# EAGLE design V3 (EAGLE 9.6.2)
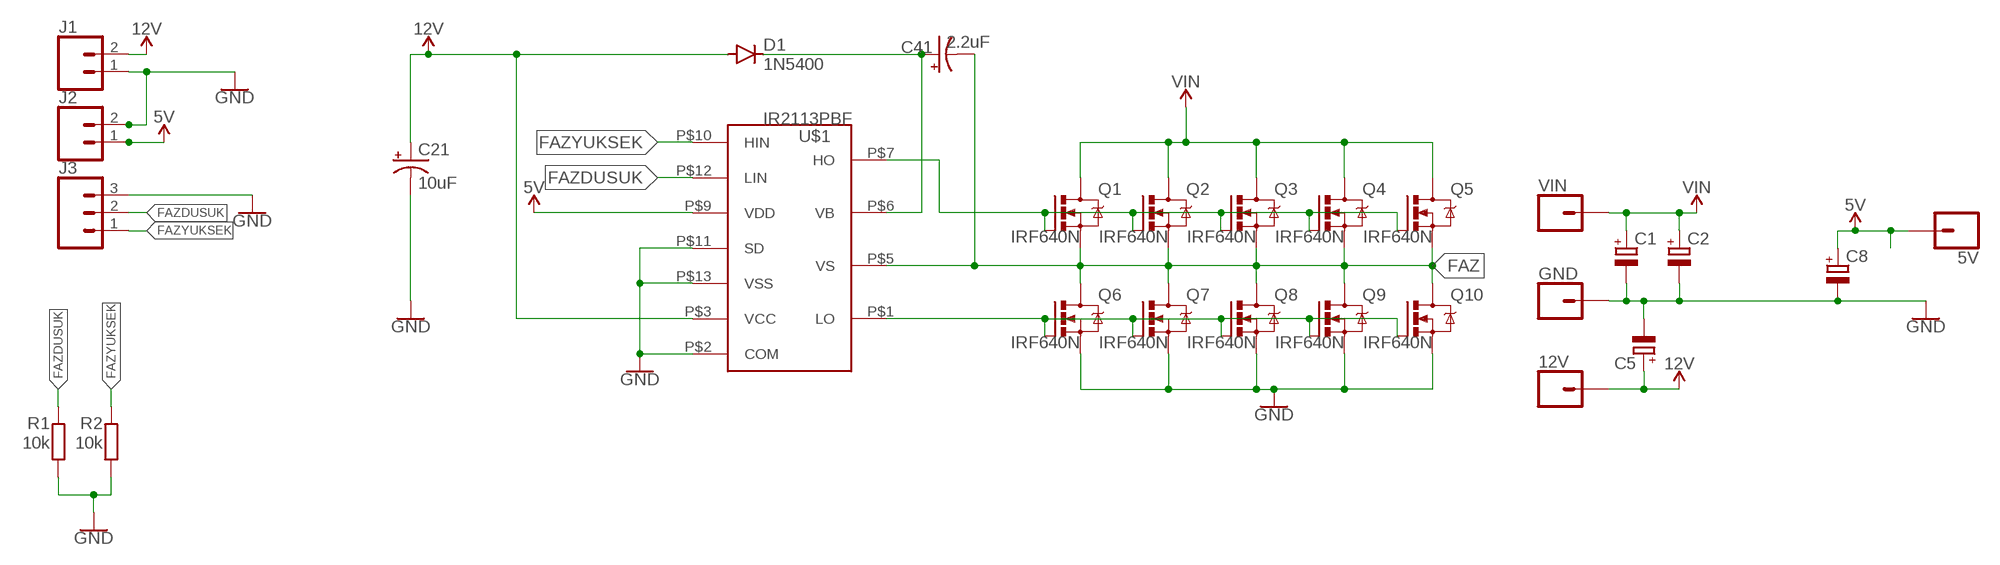
[diagram p0: schematic, sheet 1]

## Parts
5V  CONN_01SNAP-MALE  [SNAP-MALE]
12V  CONN_01SNAP-MALE  [SNAP-MALE]
C1  16MM-DIA-CAPASITOR  [16MM-DIA-CAPASITOR]
C2  16MM-DIA-CAPASITOR  [16MM-DIA-CAPASITOR]
C5  16MM-DIA-CAPASITOR  [16MM-DIA-CAPASITOR]
C8  16MM-DIA-CAPASITOR  [16MM-DIA-CAPASITOR]
C21  10uF  10UF-POLAR-RADIAL-2.5MM-25V-20%  [CPOL-RADIAL-2.5MM-5MM]
C41  2.2uF  10UF-POLAR-RADIAL-2.5MM-25V-20%  [CPOL-RADIAL-2.5MM-5MM]
D1  1N5400  [DO201-15]
GND  CONN_01SNAP-MALE  [SNAP-MALE]
J1  CONN_025MM  [SCREWTERMINAL-5MM-2]
J2  CONN_025MM  [SCREWTERMINAL-5MM-2]
J3  CONN_03-SCREW-5MM  [SCREWTERMINAL-5MM-3]
Q1  IRF640N  [TO-220-PAD]
Q2  IRF640N  [TO-220-PAD]
Q3  IRF640N  [TO-220-PAD]
Q4  IRF640N  [TO-220-PAD]
Q5  IRF640N  [TO-220-PAD]
Q6  IRF640N  [TO-220-PAD]
Q7  IRF640N  [TO-220-PAD]
Q8  IRF640N  [TO-220-PAD]
Q9  IRF640N  [TO-220-PAD]
Q10  IRF640N  [TO-220-PAD]
R1  10k  R-EU_0207/10  [0207/10]
R2  10k  R-EU_0207/10  [0207/10]
U$1  IR2113PBF  [PDIP-14]
VIN  CONN_01SNAP-MALE  [SNAP-MALE]

## Nets
5V: 5V.2 C8.+ J2.1 U$1.P$9(VDD)
12V: 12V.2 C5.+ C21.1(+) D1.A J1.2 U$1.P$3(VCC)
FAZ: C41.2(-) Q1.3(S) Q2.3(S) Q3.3(S) Q4.3(S) Q5.3(S) Q6.TAB(D) Q7.TAB(D) Q8.TAB(D) Q9.TAB(D) Q10.TAB(D) U$1.P$5(VS)
FAZ_A_L: Q6.1(G) Q7.1(G) Q8.1(G) Q9.1(G) Q10.1(G) U$1.P$1(LO)
FAZDUSUK: J3.2 R1.2 U$1.P$12(LIN)
FAZYUKSEK: J3.1 R2.2 U$1.P$10(HIN)
GND: C1.- C2.- C5.- C8.- C21.2(-) GND.2 J1.1 J2.2 J3.3 Q6.3(S) Q7.3(S) Q8.3(S) Q9.3(S) Q10.3(S) R1.1 R2.1 U$1.P$2(COM) U$1.P$11(SD) U$1.P$13(VSS)
N$1: Q1.1(G) Q2.1(G) Q3.1(G) Q4.1(G) Q5.1(G) U$1.P$7(HO)
N$4: C41.1(+) D1.C U$1.P$6(VB)
VIN: C1.+ C2.+ Q1.TAB(D) Q2.TAB(D) Q3.TAB(D) Q4.TAB(D) Q5.TAB(D) VIN.2

## Library data of the parts
5V 12V GND VIN = SparkFun-Connectors:CONN_01: Single connection point. Often used as Generic Header-pin footprint for 0.1 inch spaced/style header connections On any of the 0.1 inch spaced packages, you can populate with these: Break Away Headers - Straight <https://www.sparkfun.com/products/116> (PRT-00116) Break Away Male Headers - Right Angle <https://www.sparkfun.com/products/553> (PRT-00553) Female Headers <https://www.sparkfun.com/products/115> (PRT-00115) Break Away Headers - Machine Pin <https://www.sparkfun.com/products/117> (PRT-00117) Break Away Female Headers - Swiss Machine Pin <https://www.sparkfun.com/products/743> (PRT-00743) This device is also useful as a general connection point to wire up your design to another part of your project. Our various solder wires solder well into these plated through hole pads. Hook-Up Wire - Assortment (Stranded, 22 AWG) <https://www.sparkfun.com/products/11375> (PRT-11375) Hook-Up Wire - Assortment (Solid Core, 22 AWG) <https://www.sparkfun.com/products/11367> (PRT-11367) View the entire wire category on our website here <https://www.sparkfun.com/categories/141> Special notes: SMTSO-256-ET is a "flush mount" nut for a 4-40 screw. We mostly use this on specialty testbeds; it is a nice way to connect hardware to your PCB at an adjustable hieght. Also note, the SNAP packages are for using a snappable style connector. We sell a baggie of snaps and they are also used on two LilyPad designs: Snap Assortment - 30 pack (male and female) <https://www.sparkfun.com/products/11347> (DEV-11347) LilyPad Arduino SimpleSnap <https://www.sparkfun.com/products/10941> (DEV-10941) LilyPad SimpleSnap Protoboard <https://www.sparkfun.com/products/10940> (DEV-10940)
C1 C2 C5 C8 = El_yapimi:16MM-DIA-CAPASITOR
C21 = SparkFun-Capacitors:10UF-POLAR: 10.0µF polarized capacitors A capacitor is a passive two-terminal electrical component used to store electrical energy temporarily in an electric field.; PROD_ID: CAP-08440
C41 = SparkFun-Capacitors:10UF-POLAR: 10.0µF polarized capacitors A capacitor is a passive two-terminal electrical component used to store electrical energy temporarily in an electric field.; PROD_ID: CAP-08440; VALUE: 10uF
D1 = diode:1N5400: DIODE standard rectifier, 3 A, 50 V (Motorola)
J1 J2 = SparkFun-Connectors:CONN_02: Multi connection point. Often used as Generic Header-pin footprint for 0.1 inch spaced/style header connections On any of the 0.1 inch spaced packages, you can populate with these: Break Away Headers - Straight <https://www.sparkfun.com/products/116> (PRT-00116) Break Away Male Headers - Right Angle <https://www.sparkfun.com/products/553> (PRT-00553) Female Headers <https://www.sparkfun.com/products/115> (PRT-00115) Break Away Headers - Machine Pin <https://www.sparkfun.com/products/117> (PRT-00117) Break Away Female Headers - Swiss Machine Pin <https://www.sparkfun.com/products/743> (PRT-00743) For SCREWTERMINALS and SPRING TERMINALS visit here: Screw Terimnals on SparkFun.com <https://www.sparkfun.com/search/results?term=Screw+Terminals> (5mm/3.5mm/2.54mm spacing) This device is also useful as a general connection point to wire up your design to another part of your project. Our various solder wires solder well into these plated through hole pads. Hook-Up Wire - Assortment (Stranded, 22 AWG) <https://www.sparkfun.com/products/11375> (PRT-11375) Hook-Up Wire - Assortment (Solid Core, 22 AWG) <https://www.sparkfun.com/products/11367> (PRT-11367) View the entire wire category on our website here <https://www.sparkfun.com/categories/141> Special notes: Molex polarized connector foot print use with: PRT-08233 with associated crimp pins and housings. 2.54_SCREWTERM for use with PRT-10571. 3.5mm Screw Terminal footprints for PRT-08084 5mm Screw Terminal footprints for use with PRT-08432; SF_SKU: PRT-08432
J3 = SparkFun-Connectors:CONN_03: Multi connection point. Often used as Generic Header-pin footprint for 0.1 inch spaced/style header connections On any of the 0.1 inch spaced packages, you can populate with these: Break Away Headers - Straight <https://www.sparkfun.com/products/116> (PRT-00116) Break Away Male Headers - Right Angle <https://www.sparkfun.com/products/553> (PRT-00553) Female Headers <https://www.sparkfun.com/products/115> (PRT-00115) Break Away Headers - Machine Pin <https://www.sparkfun.com/products/117> (PRT-00117) Break Away Female Headers - Swiss Machine Pin <https://www.sparkfun.com/products/743> (PRT-00743) Stackable Header - 3 Pin (Female, 0.1") <https://www.sparkfun.com/products/13875> (PRT-13875) For SCREWTERMINALS and SPRING TERMINALS visit here: Screw Terimnals on SparkFun.com <https://www.sparkfun.com/search/results?term=Screw+Terminals> (5mm/3.5mm/2.54mm spacing) This device is also useful as a general connection point to wire up your design to another part of your project. Our various solder wires solder well into these plated through hole pads. Hook-Up Wire - Assortment (Stranded, 22 AWG) <https://www.sparkfun.com/products/11375> (PRT-11375) Hook-Up Wire - Assortment (Solid Core, 22 AWG) <https://www.sparkfun.com/products/11367> (PRT-11367) View the entire wire category on our website here <https://www.sparkfun.com/categories/141> Special notes: Molex polarized connector foot print use with SKU : PRT-08232 with associated crimp pins and housings.; PROD_ID: CONN-10134; SF_SKU: PRT-08433
Q1-Q10 = El_yapimi:IRF640N
R1 R2 = resistor:R-EU_: RESISTOR, European symbol
U$1 = El_yapimi:IR2113PBF

## Board
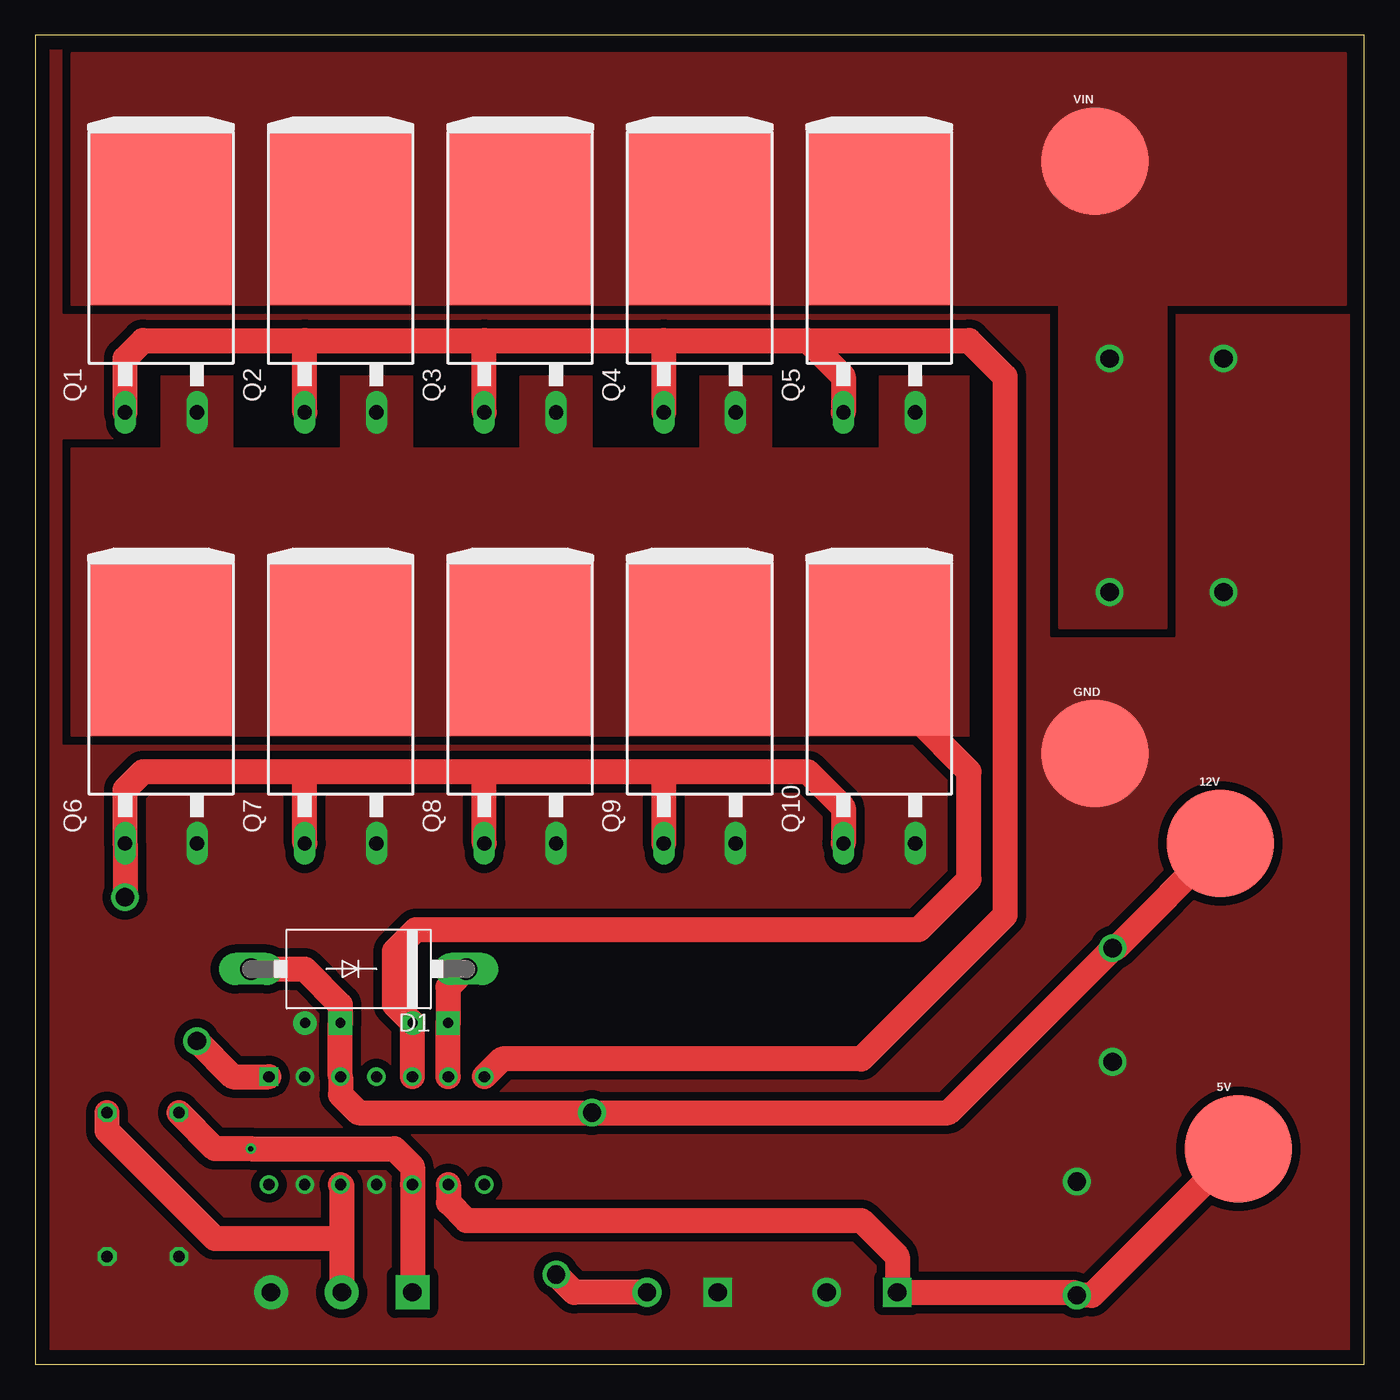
[diagram p1: board, top side]
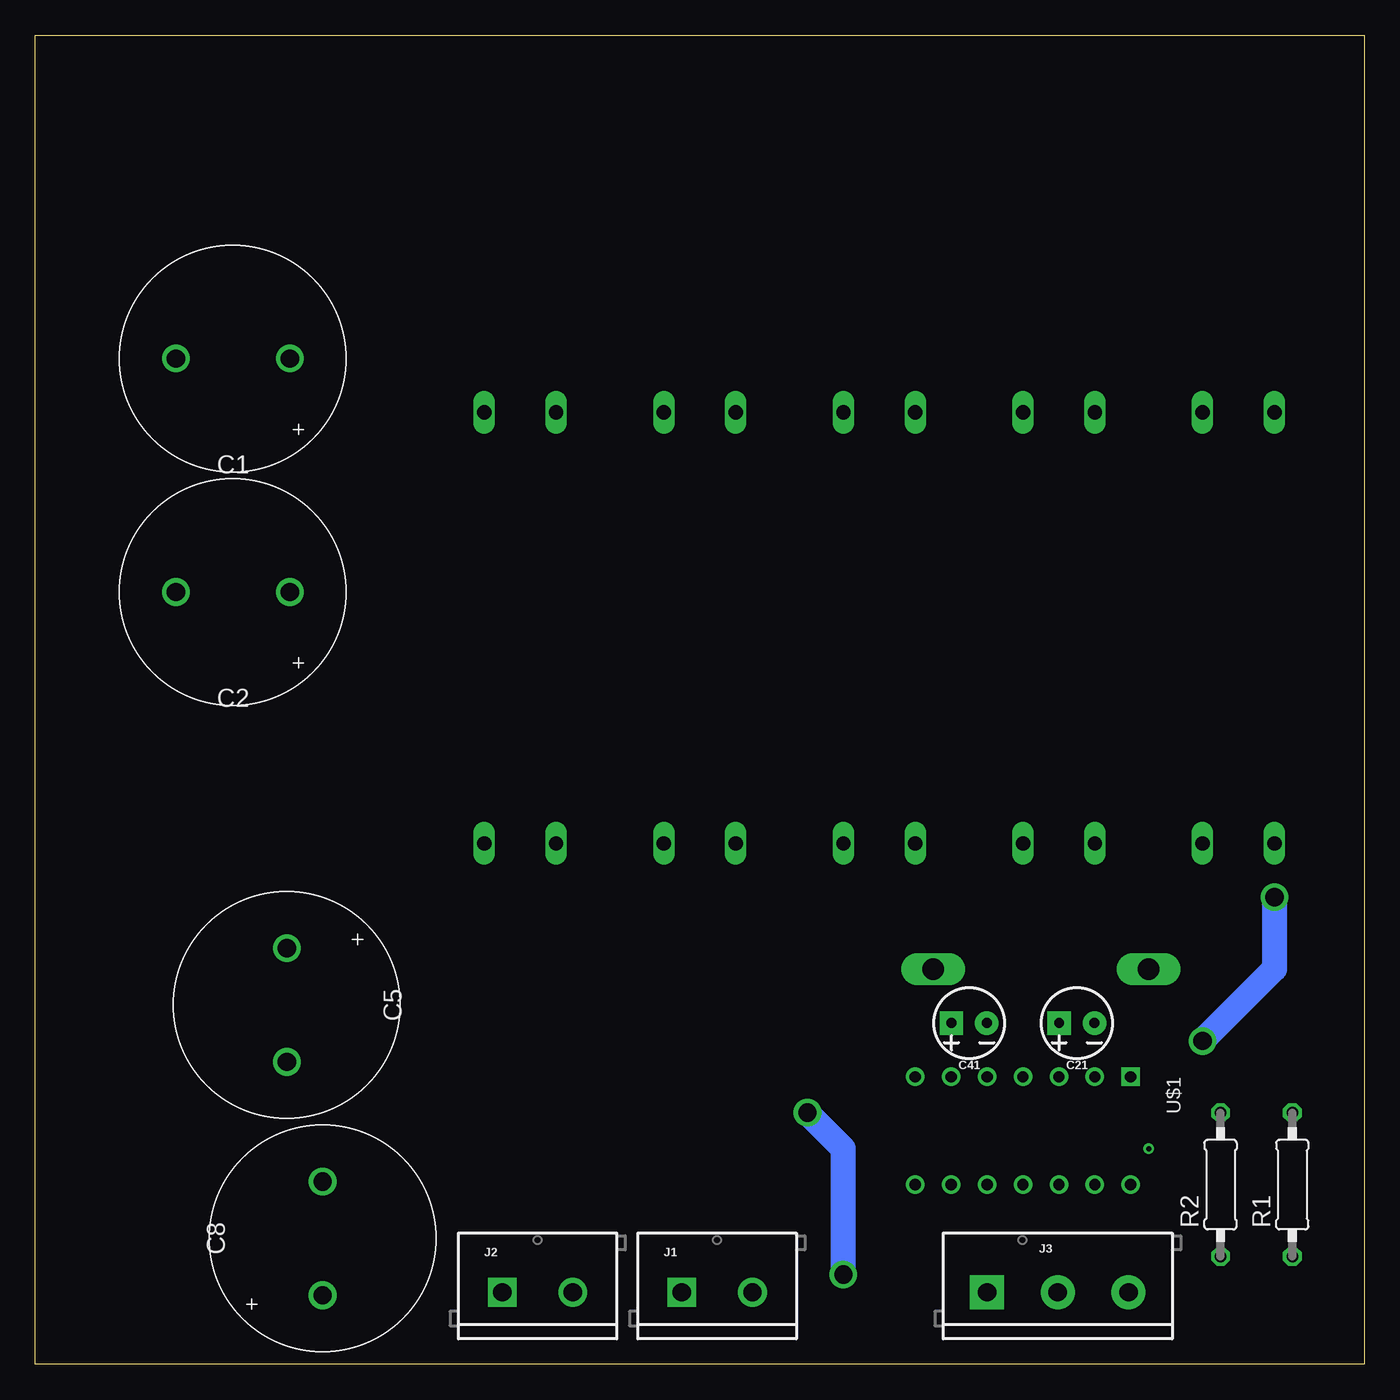
[diagram p2: board, bottom side, seen from below]

Size 93.98 x 93.98 mm. Coordinates in mm from the lower left corner, seen from the top.
Outline: 0,0 93.98,0 93.98,93.98 0,93.98 0,0
Copper layers (1*16): Top 0.035mm / dielectric 1.5mm / Bottom 0.035mm
Design rules "cnc_0.6_eagle_ayarlar": minimum track width 6mil, minimum drill 0.35mm, track to track 0.6mm, track to pad 0.6mm, pad to pad 0.6mm, via to via 0.6mm, smd to smd 0.6mm, copper to edge 40mil, drill to drill 0.6mm, minimum pad ring 10mil, minimum via ring 8mil, stop-mask expansion 4mil, vias tented up to drill 0mil, thermal gap 0.6mm

### Footprints (pad centres in the part's own frame; a part is rotated, then mirrored left to right if it is on the bottom)
SNAP-MALE = smd 7.62 x 7.62: 2 0,0
16MM-DIA-CAPASITOR = drill 1.3 pad 1.95: + -4.02,0; - 4.02,0
CPOL-RADIAL-2.5MM-5MM = drill 0.7 pad 1.651 square: 1 1.25,0 | drill 0.7 pad 1.651: 2 -1.25,0
DO201-15 = drill 1.499 long: A 7.62,0; C -7.62,0
SCREWTERMINAL-5MM-2 = drill 1.3 pad 2.032 square: 1 0,0 | drill 1.3 pad 2.032: 2 5,0
SCREWTERMINAL-5MM-3 = drill 1.3 pad 2.413 square: 1 0,0 | drill 1.3 pad 2.413: 2 5,0; 3 10,0
TO-220-PAD = drill 1.016 long: 1 -2.54,-8.89; 3 2.54,-8.89 | smd 10.16 x 12.7: TAB 0,5.08
0207/10 = drill 0.813 octagon: 1 -5.08,0; 2 5.08,0
PDIP-14 = drill 0.8 square: P$1 -3.81,7.62 | drill 0.8: P$2 -3.81,5.08; P$3 -3.81,2.54; P$4 -3.81,0; P$5 -3.81,-2.54; P$6 -3.81,-5.08; P$7 -3.81,-7.62; P$8 3.81,-7.62; P$9 3.81,-5.08; P$10 3.81,-2.54; P$11 3.81,0; P$12 3.81,2.54; P$13 3.81,5.08; P$14 3.81,7.62

### Placement (x,y rotation side)
5V  85.09,15.24 0 top
12V  83.82,36.83 0 top
C1  80.01,71.12 180 bottom
C2  80.01,54.61 180 bottom
C5  76.2,25.4 270 bottom
C8  73.66,8.89 90 bottom
C21  20.32,24.13 180 bottom
C41  27.94,24.13 180 bottom
D1  22.86,27.94 180 top
GND  74.93,43.18 0 top
J1  48.26,5.08 0 bottom
J2  60.96,5.08 0 bottom
J3  26.67,5.08 0 bottom
Q1  8.89,76.2 0 top
Q2  21.59,76.2 0 top
Q3  34.29,76.2 0 top
Q4  46.99,76.2 0 top
Q5  59.69,76.2 0 top
Q6  8.89,45.72 0 top
Q7  21.59,45.72 0 top
Q8  34.29,45.72 0 top
Q9  46.99,45.72 0 top
Q10  59.69,45.72 0 top
R1  5.08,12.7 90 bottom
R2  10.16,12.7 90 bottom
U$1  24.13,16.51 270 bottom
VIN  74.93,85.09 0 top

### Tracks (layer width: path | path; a pad name or v marks a point on that pad's centre or on a via)
5V
  Top 1.778: U$1.P$9 29.21,11.43 30.48,10.16 58.42,10.16 60.96,7.62 J2.1 73.45,5.08 C8.+ 74.72,4.87 5V.2
12V  (via drill 1.3)
  Top 1.778: 12V.2 76.41,29.42 C5.+ 64.56,17.78 v39.37,17.78 22.86,17.78 21.59,19.05 U$1.P$3 21.57,20.34 C21.1 21.57,25.42 19.05,27.94 D1.A | J1.2 38.1,5.08 v36.83,6.35
  Bottom 1.778: v36.83,6.35 36.83,15.24 v39.37,17.78
FAZ
  Top 1.778: U$1.P$5 26.67,24.11 C41.2 25.4,25.42 25.4,29.21 26.92,30.73 62.48,30.73 66.04,34.29 66.04,41.91 62.23,45.72
  pour Top (no thermals): 8.89,69.85 8.89,64.77 2.54,64.77 2.54,44.45 66.04,44.45 66.04,69.85 59.69,69.85 59.69,64.77 52.07,64.77 52.07,69.85 46.99,69.85 46.99,64.77 39.37,64.77 39.37,69.85 34.29,69.85 34.29,64.77 26.67,64.77 26.67,69.85 21.59,69.85 21.59,64.77 13.97,64.77 13.97,69.85
FAZ_A_L  (via drill 1.3)
  Top 1.778: 19.05,41.91 7.62,41.91 6.35,40.64 Q6.1 v6.35,33.02 | 19.05,41.91 31.75,41.91 | 31.75,41.91 44.45,41.91 | 44.45,41.91 54.61,41.91 57.15,39.37 Q10.1 | Q9.1 44.45,41.91 | Q8.1 31.75,41.91 | Q7.1 19.05,41.91 | U$1.P$1 13.97,20.32 v11.43,22.86
  Bottom 1.778: v6.35,33.02 6.35,27.94 v11.43,22.86
FAZDUSUK
  Top 1.778: U$1.P$12 21.67,12.62 21.67,8.89 | 21.67,8.89 J3.2 | 21.67,8.89 12.7,8.89 5.08,16.51 R1.2
FAZYUKSEK  (via drill 0.35)
  Top 1.778: J3.1 U$1.P$10 26.67,13.97 25.4,15.24 v15.24,15.24 12.7,15.24 R2.2
GND
  pour Top (rank 4, no thermals): -1.27,95.25 -1.27,-1.27 95.25,-1.27 95.25,95.25
N$1
  Top 1.778: Q1.1 6.35,71.12 7.62,72.39 19.05,72.39 | 19.05,72.39 31.75,72.39 | 31.75,72.39 44.45,72.39 | 44.45,72.39 54.61,72.39 | 54.61,72.39 57.15,69.85 Q5.1 | Q4.1 44.45,72.39 | Q3.1 31.75,72.39 | Q2.1 19.05,72.39 | 54.61,72.39 66.04,72.39 68.58,69.85 68.58,31.75 58.42,21.59 33.02,21.59 U$1.P$7
N$4
  Top 1.778: U$1.P$6 29.19,20.34 C41.1 | C41.1 29.21,24.15 | C41.1 29.19,26.65 D1.C
VIN
  pour Top (no thermals): 2.54,92.71 2.54,74.93 72.39,74.93 72.39,52.07 80.01,52.07 80.01,74.93 92.71,74.93 92.71,92.71